# EAGLE design InputModule (EAGLE 7.6.0)
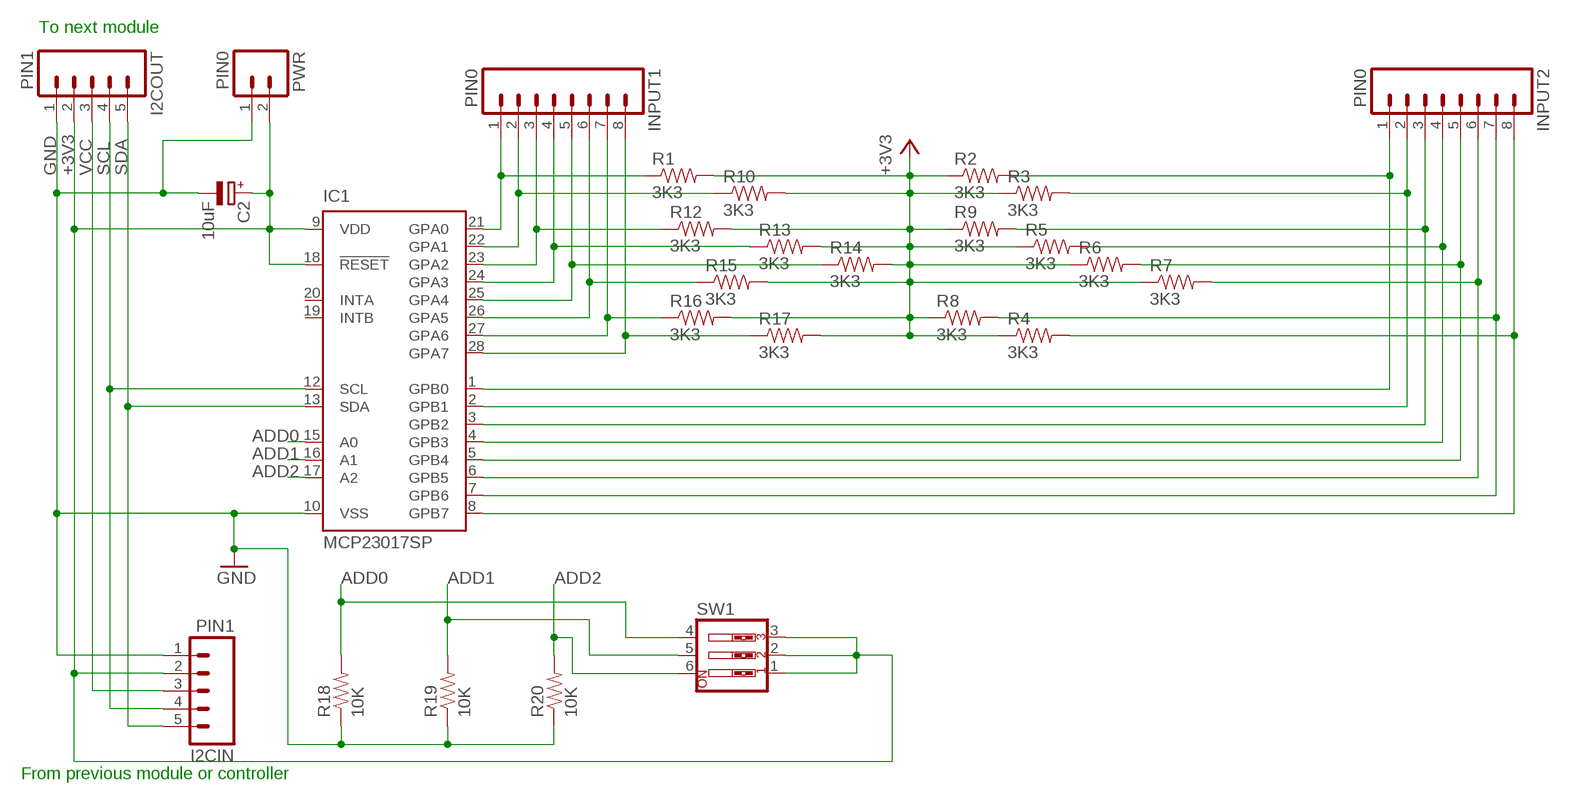
[diagram p0: schematic, sheet 1]

## Parts
C2  10uF  CPOL-EUE2.5-6  [E2,5-6]
I2CIN  PIN1  M05  [05P]
I2COUT  PIN1  M05  [05P]
IC1  MCP23017SP  [DIL28-3]
INPUT1  PIN0  M08  [1X08_ROUND]
INPUT2  PIN0  M08  [1X08_ROUND]
PWR  PIN0  M02  [02P]
R1  3K3  RESISTORPTH-1/4W  [AXIAL-0.4]
R2  3K3  RESISTORPTH-1/4W  [AXIAL-0.4]
R3  3K3  RESISTORPTH-1/4W  [AXIAL-0.4]
R4  3K3  RESISTORPTH-1/4W  [AXIAL-0.4]
R5  3K3  RESISTORPTH-1/4W  [AXIAL-0.4]
R6  3K3  RESISTORPTH-1/4W  [AXIAL-0.4]
R7  3K3  RESISTORPTH-1/4W  [AXIAL-0.4]
R8  3K3  RESISTORPTH-1/4W  [AXIAL-0.4]
R9  3K3  RESISTORPTH-1/4W  [AXIAL-0.4]
R10  3K3  RESISTORPTH-1/4W  [AXIAL-0.4]
R12  3K3  RESISTORPTH-1/4W  [AXIAL-0.4]
R13  3K3  RESISTORPTH-1/4W  [AXIAL-0.4]
R14  3K3  RESISTORPTH-1/4W  [AXIAL-0.4]
R15  3K3  RESISTORPTH-1/4W  [AXIAL-0.4]
R16  3K3  RESISTORPTH-1/4W  [AXIAL-0.4]
R17  3K3  RESISTORPTH-1/4W  [AXIAL-0.4]
R18  10K  RESISTORPTH-1/4W  [AXIAL-0.4]
R19  10K  RESISTORPTH-1/4W  [AXIAL-0.4]
R20  10K  RESISTORPTH-1/4W  [AXIAL-0.4]
SW1  SW_DIP-3  [EDG-03]

## Nets
+3V3: C2.+ I2CIN.2 I2COUT.2 IC1.9(VDD) IC1.18(!RESET) PWR.2 R1.P$2 R2.P$1 R3.P$1 R4.P$1 R5.P$1 R6.P$1 R7.P$1 R8.P$1 R9.P$1 R10.P$2 R12.P$2 R13.P$2 R14.P$2 R15.P$2 R16.P$2 R17.P$2 SW1.1 SW1.2 SW1.3
ADD0: IC1.15(A0) R18.P$2 SW1.4
ADD1: IC1.16(A1) R19.P$2 SW1.5
ADD2: IC1.17(A2) R20.P$2 SW1.6
GND: C2.- I2CIN.1 I2COUT.1 IC1.10(VSS) PWR.1 R18.P$1 R19.P$1 R20.P$1
N$1: IC1.1(GPB0) INPUT2.1 R2.P$2
N$2: IC1.2(GPB1) INPUT2.2 R3.P$2
N$3: IC1.3(GPB2) INPUT2.3 R9.P$2
N$4: IC1.4(GPB3) INPUT2.4 R5.P$2
N$5: IC1.5(GPB4) INPUT2.5 R6.P$2
N$6: IC1.6(GPB5) INPUT2.6 R7.P$2
N$7: IC1.7(GPB6) INPUT2.7 R8.P$2
N$8: IC1.8(GPB7) INPUT2.8 R4.P$2
N$19: IC1.21(GPA0) INPUT1.1 R1.P$1
N$20: IC1.22(GPA1) INPUT1.2 R10.P$1
N$21: IC1.23(GPA2) INPUT1.3 R12.P$1
N$22: IC1.24(GPA3) INPUT1.4 R13.P$1
N$23: IC1.25(GPA4) INPUT1.5 R14.P$1
N$24: IC1.26(GPA5) INPUT1.6 R15.P$1
N$25: IC1.27(GPA6) INPUT1.7 R16.P$1
N$26: IC1.28(GPA7) INPUT1.8 R17.P$1
SCL: I2CIN.4 I2COUT.4 IC1.12(SCL)
SDA: I2CIN.5 I2COUT.5 IC1.13(SDA)
VCC: I2CIN.3 I2COUT.3
Unconnected: IC1.19(INTB) IC1.20(INTA)

## Notes on the sheet
- To next module
- From previous module or controller

## Library data of the parts
C2 = rcl:CPOL-EU: POLARIZED CAPACITOR, European symbol
I2CIN I2COUT = con-amp-quick:M05: AMP QUICK CONNECTOR; OC_FARNELL: unknown; OC_NEWARK: unknown
IC1 = microchip:MCP23017: http://ww1.microchip.com/downloads/en/DeviceDoc/21952a.pdf Source: http://ww1.microchip.com/downloads/en/DeviceDoc/21952a.pdf; MF: MICROCHIP; MPN: MCP23017-E/SP; OC_FARNELL: 1332088; OC_NEWARK: 31K2959
INPUT1 INPUT2 = SparkFun-Connectors:M08: Header 8 Standard 8-pin 0.1" header. Use with straight break away headers (SKU : PRT-00116), right angle break away headers (PRT-00553), swiss pins (PRT-00743), machine pins (PRT-00117), and female headers (PRT-00115).; PROD_ID: CONN-08437
PWR = con-amp-quick:M02: AMP QUICK CONNECTOR; OC_FARNELL: unknown; OC_NEWARK: unknown
R1-R10 R12-R20 = SparkFun-Passives:RESISTOR: Resistor Basic schematic elements and footprints for 0603, 1206, and PTH resistors.
SW1 = special:SW_DIP-3: DIP SWITCH

## Board
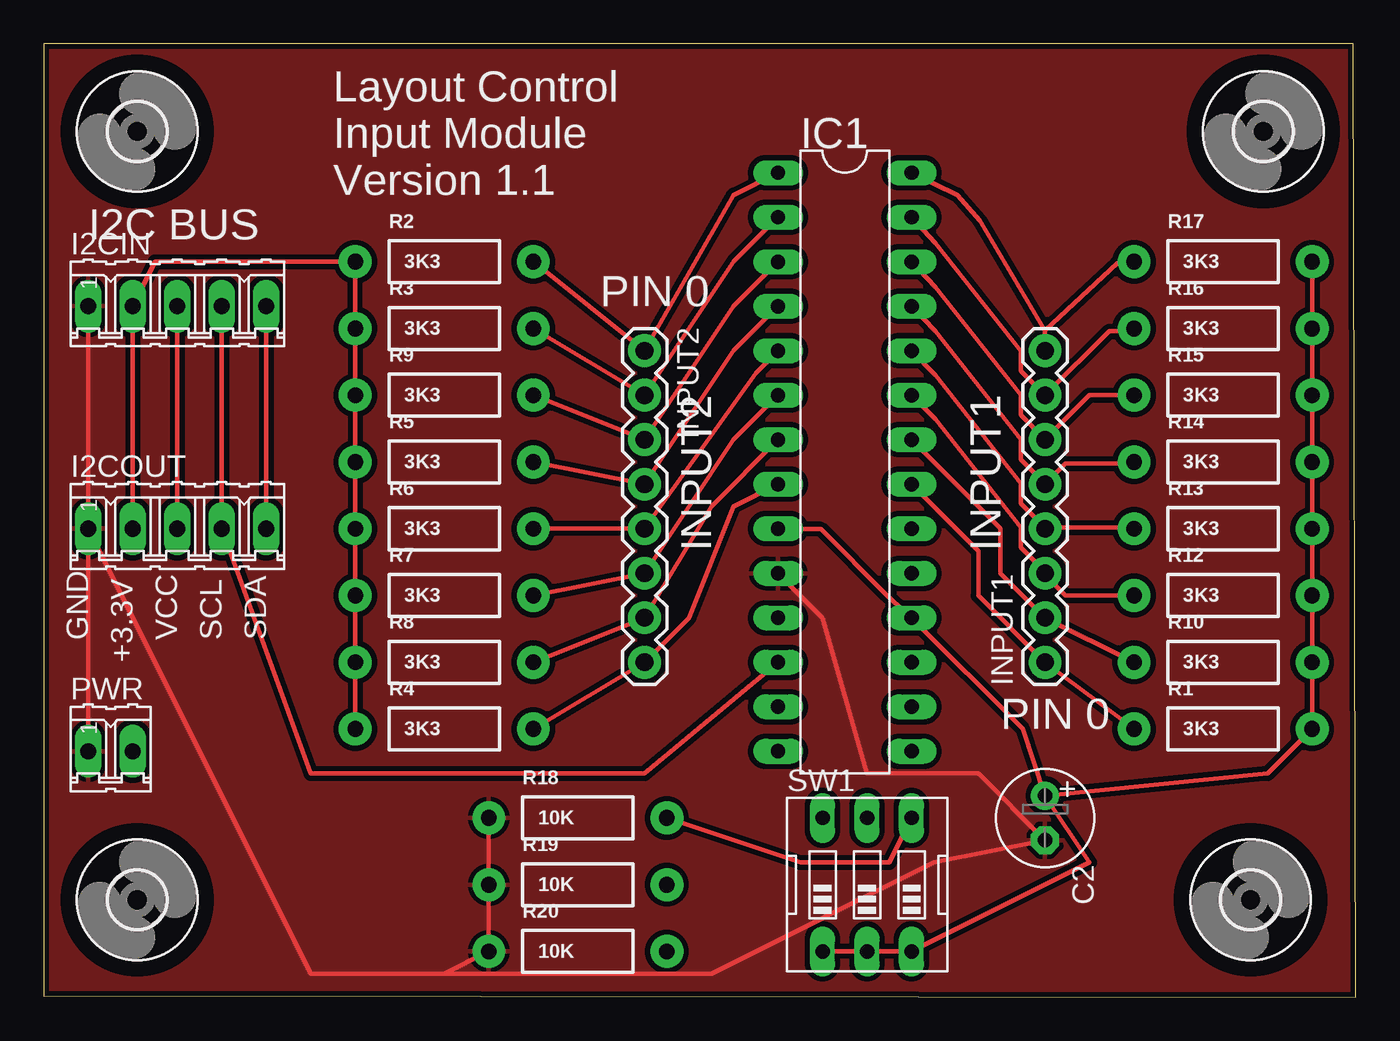
[diagram p1: board, top side]
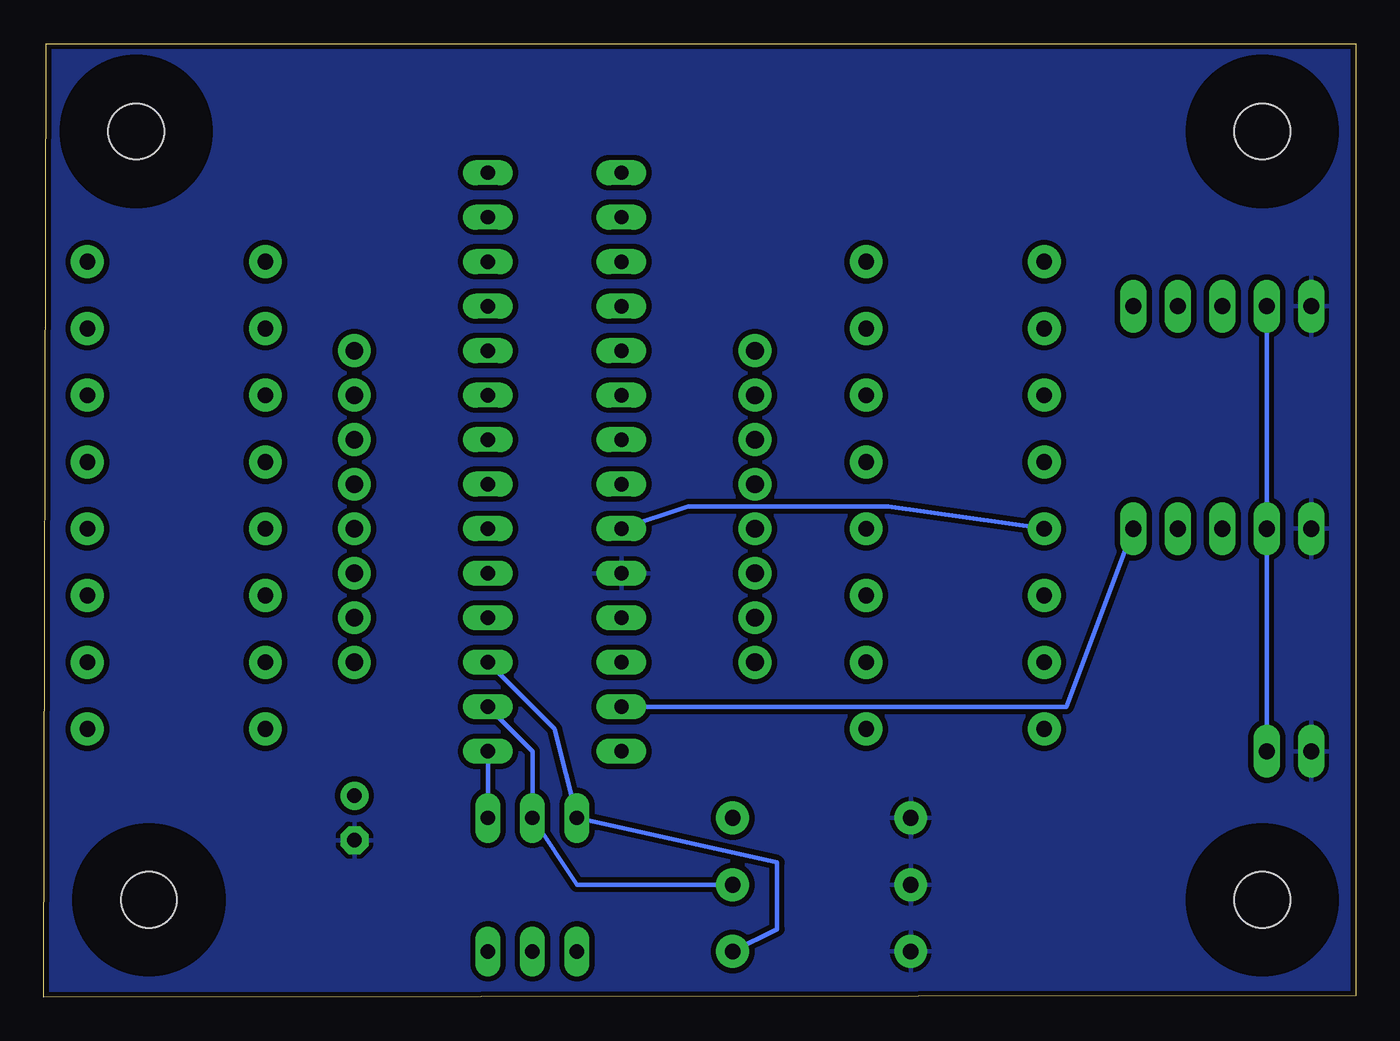
[diagram p2: board, bottom side, seen from below]

Size 74.88 x 54.41 mm. Coordinates in mm from the lower left corner, seen from the top.
Outline: 0,0.06 74.88,0 74.75,54.41 0,54.41 0,0.06
Copper layers (1*16): Top 0.035mm / dielectric 1.5mm / Bottom 0.035mm
Design rules "SparkFun": minimum track width 8mil, minimum drill 20mil, track to track 8mil, track to pad 8mil, pad to pad 8mil, via to via 8mil, smd to smd 8mil, copper to edge 8mil, drill to drill 8mil, minimum pad ring 12mil, minimum via ring 10mil, stop-mask expansion 4mil, vias tented up to drill 20mil, thermal gap 10mil

### Footprints (pad centres in the part's own frame; a part is rotated, then mirrored left to right if it is on the bottom)
E2,5-6 = drill 0.813 pad 1.6: + -1.27,0 | drill 0.813 pad 1.6 octagon: - 1.27,0
05P = drill 0.914 long: 1 -5.08,0; 2 -2.54,0; 3 0,0; 4 2.54,0; 5 5.08,0
DIL28-3 = drill 0.813 long: 1 -16.51,-3.81; 2 -13.97,-3.81; 3 -11.43,-3.81; 4 -8.89,-3.81; 5 -6.35,-3.81; 6 -3.81,-3.81; 7 -1.27,-3.81; 8 1.27,-3.81; 9 3.81,-3.81; 10 6.35,-3.81; 11 8.89,-3.81; 12 11.43,-3.81; 13 13.97,-3.81; 14 16.51,-3.81; 15 16.51,3.81; 16 13.97,3.81; 17 11.43,3.81; 18 8.89,3.81; 19 6.35,3.81; 20 3.81,3.81; 21 1.27,3.81; 22 -1.27,3.81; 23 -3.81,3.81; 24 -6.35,3.81; 25 -8.89,3.81; 26 -11.43,3.81; 27 -13.97,3.81; 28 -16.51,3.81
1X08_ROUND = drill 1.016 pad 1.88: 1 0,0; 2 2.54,0; 3 5.08,0; 4 7.62,0; 5 10.16,0; 6 12.7,0; 7 15.24,0; 8 17.78,0
02P = drill 0.914 long: 1 -1.27,0; 2 1.27,0
AXIAL-0.4 = drill 0.9 pad 1.88: P$1 -5.08,0; P$2 5.08,0
EDG-03 = drill 0.813 long: 1 -2.54,-3.81; 2 0,-3.81; 3 2.54,-3.81; 4 2.54,3.81; 5 0,3.81; 6 -2.54,3.81
3,2 = hole 3.2: 0,0

### Placement (x,y rotation side)
C2  57.15,10.22 270 top
I2CIN  7.62,39.43 0 top
I2COUT  7.62,26.73 0 top
IC1  45.72,30.54 270 top
INPUT1  57.15,19.11 90 top
INPUT2  34.29,36.89 270 top
PWR  3.81,14.03 0 top
R1  67.31,15.3 0 top
R2  22.86,41.97 0 top
R3  22.86,38.16 0 top
R4  22.86,15.3 0 top
R5  22.86,30.54 0 top
R6  22.86,26.73 0 top
R7  22.86,22.92 0 top
R8  22.86,19.11 0 top
R9  22.86,34.35 0 top
R10  67.31,19.11 0 top
R12  67.31,22.92 0 top
R13  67.31,26.73 0 top
R14  67.31,30.54 0 top
R15  67.31,34.35 0 top
R16  67.31,38.16 0 top
R17  67.31,41.97 0 top
R18  30.48,10.22 0 top
R19  30.48,6.41 0 top
R20  30.48,2.6 0 top
SW1  46.99,6.41 0 top
U$1  [3,2]  5.33,49.41 0 top
U$2  [3,2]  69.61,49.41 0 top
U$3  [3,2]  68.88,5.56 0 top
U$4  [3,2]  5.33,5.56 0 top

### Tracks (layer width: path | path; a pad name or v marks a point on that pad's centre or on a via)
+3V3
  Top 0.254: IC1.9 43.33,26.71 44.35,26.71 48.11,22.95 IC1.18 55.88,15.3 C2.+ | I2COUT.2 I2CIN.2 6.35,41.97 R2.P$1 R3.P$1 R9.P$1 R5.P$1 R6.P$1 R7.P$1 R8.P$1 R4.P$1 | R17.P$2 R16.P$2 R15.P$2 R14.P$2 R13.P$2 R12.P$2 R10.P$2 R1.P$2 69.85,12.76 C2.+ | SW1.1 SW1.2 SW1.3 59.69,7.68 C2.+
  Bottom 0.254: I2CIN.2 I2COUT.2 PWR.2 | R6.P$1 26.67,28 38.1,28 IC1.9
ADD0
  Top 0.254: R18.P$2 43.18,7.68 48.26,7.68 SW1.4
  Bottom 0.254: SW1.4 IC1.15
ADD1
  Bottom 0.254: IC1.16 46.99,14.03 SW1.5 44.45,6.41 R19.P$2
ADD2
  Bottom 0.254: IC1.17 45.72,15.3 SW1.6 33.02,7.68 33.02,3.87 R20.P$2
GND
  Top 0.254: I2CIN.1 I2COUT.1 | IC1.10 44.45,21.65 46.99,12.76 53.34,12.76 C2.- 50.8,7.68 38.1,1.33 22.86,1.33 | I2COUT.1 15.24,1.33 22.86,1.33 | R18.P$1 R19.P$1 R20.P$1 22.86,1.33 | PWR.1 I2COUT.1
  pour Bottom (isolate 0.305): 0,0.06 0,54.67 74.93,54.67 74.93,0.06
  pour Top (isolate 0.305): 0,0.06 0,54.67 74.93,54.67 74.93,0.06
N$1
  Top 0.254: R2.P$2 INPUT2.1 39.37,45.78 IC1.1
N$2
  Top 0.254: R3.P$2 INPUT2.2 39.37,41.97 IC1.2
N$3
  Top 0.254: R9.P$2 INPUT2.3 39.37,39.43 IC1.3
N$4
  Top 0.254: IC1.4 39.37,36.89 INPUT2.4 R5.P$2
N$5
  Top 0.254: IC1.5 40.64,35.62 INPUT2.5 R6.P$2
N$6
  Top 0.254: IC1.6 39.37,31.81 INPUT2.6 R7.P$2
N$7
  Top 0.254: IC1.7 38.1,28 INPUT2.7 R8.P$2
N$8
  Top 0.254: R4.P$2 INPUT2.8 36.83,21.65 39.37,28 IC1.8
N$9
  pour Bottom (isolate 0.305): 0,0.06 0,54.67 74.93,54.67 74.93,0.06
N$19
  Top 0.254: R1.P$1 INPUT1.1 53.34,22.92 53.34,25.46 IC1.21
N$20
  Top 0.254: R10.P$1 INPUT1.2 54.61,24.19 54.61,26.73 IC1.22
N$21
  Top 0.254: IC1.23 50.88,32.98 55.78,26.81 55.78,25.67 57.15,24.29 INPUT1.3 57.15,24.07 58.29,22.92 R12.P$1
N$22
  Top 0.254: 57.15,26.81 55.78,28.18 55.78,29.32 50.88,35.5 IC1.24 | 57.15,26.81 62.18,26.81 R13.P$1 | 57.15,26.81 INPUT1.4
N$23
  Top 0.254: 57.15,29.32 55.78,30.69 55.78,31.84 50.88,38.01 IC1.25 | 57.15,29.32 58.29,30.47 62.18,30.47 R14.P$1 | 57.15,29.32 INPUT1.5
N$24
  Top 0.254: 57.15,31.84 55.78,33.21 55.78,34.35 50.88,40.52 IC1.26 | R15.P$1 59.66,34.35 57.15,31.84 | 57.15,31.84 INPUT1.6
N$25
  Top 0.254: IC1.27 50.88,43.04 55.78,36.87 55.78,35.72 INPUT1.7 60.81,38.01 62.18,38.01 R16.P$1
N$26
  Top 0.254: 57.15,38.03 53.42,44.31 52.15,45.78 IC1.28 | 57.15,38.03 INPUT1.8 57.15,37.1 | 57.15,38.03 61.27,41.9 62.18,41.9 R17.P$1
SCL
  Top 0.254: I2CIN.4 I2COUT.4 15.24,12.76 34.29,12.76 IC1.12
SDA
  Top 0.254: I2CIN.5 I2COUT.5
  Bottom 0.254: I2COUT.5 16.51,16.57 IC1.13
VCC
  Top 0.254: I2CIN.3 I2COUT.3
  Bottom 0.254: I2COUT.3 7.62,25.46

### Text on the board
tPlace: Layout Control / Input Module / Version 1.1 | I2C BUS | PIN 0 | INPUT2 | INPUT1 | GND | VCC | SCL | SDA | +3.3V | PIN 0